# Altium schematic sheet rf-switch.SchDoc: Mini RF Synth [Master]
size A4; DocumentNumber: 1; SheetNumber: 1; SheetTotal: 1
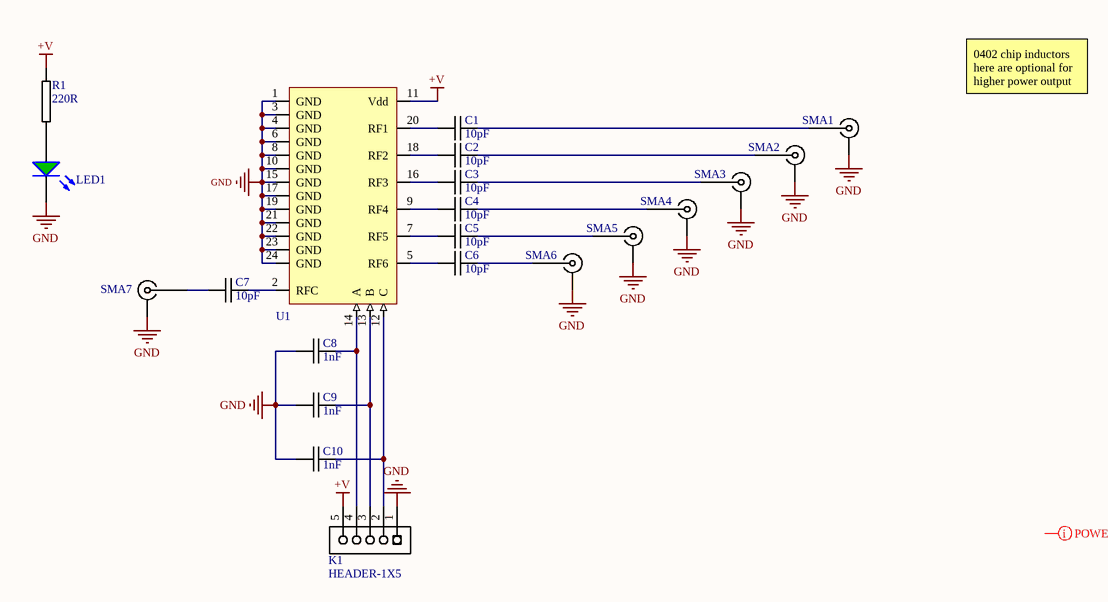
[diagram p0: rf-switch.SchDoc]

## Parts
C1  10pF  [0603C-GENERIC]
C2  10pF  [0603C-GENERIC]
C3  10pF  [0603C-GENERIC]
C4  10pF  [0603C-GENERIC]
C5  10pF  [0603C-GENERIC]
C6  10pF  [0603C-GENERIC]
C7  10pF  [0603C-GENERIC]
C8  1nF  [0603C-GENERIC]
C9  1nF  [0603C-GENERIC]
C10  1nF  [0603C-GENERIC]
K1  HEADER-1X5  [HEADER-1X5]
LED1  Green  [0805LED - GREEN]  (value not drawn)
R1  220R  [0603R-220]
SMA1  MOLEX_SMA_EDGE  [MOLEX_SMA_EDGE]  (value not drawn)
SMA2  MOLEX_SMA_EDGE  [MOLEX_SMA_EDGE]  (value not drawn)
SMA3  MOLEX_SMA_EDGE  [MOLEX_SMA_EDGE]  (value not drawn)
SMA4  MOLEX_SMA_EDGE  [MOLEX_SMA_EDGE]  (value not drawn)
SMA5  MOLEX_SMA_EDGE  [MOLEX_SMA_EDGE]  (value not drawn)
SMA6  MOLEX_SMA_EDGE  [MOLEX_SMA_EDGE]  (value not drawn)
SMA7  MOLEX_SMA_EDGE  [MOLEX_SMA_EDGE]  (value not drawn)
U1  HMC252A  [HMC252A-QSOP24]  (value not drawn)

## Nets
+V: K1.5 R1.1 U1.11(Vdd)
GND: C8.1 C9.1 C10.1 K1.1 LED1.K SMA1.2 SMA2.2 SMA3.2 SMA4.2 SMA5.2 SMA6.2 SMA7.2 U1.1(GND) U1.3(GND) U1.4(GND) U1.6(GND) U1.8(GND) U1.10(GND) U1.15(GND) U1.17(GND) U1.19(GND) U1.21(GND) U1.22(GND) U1.23(GND) U1.24(GND)
NetC1_1: C1.1 U1.20(RF1)
NetC1_2: C1.2 SMA1.1
NetC2_1: C2.1 U1.18(RF2)
NetC2_2: C2.2 SMA2.1
NetC3_1: C3.1 U1.16(RF3)
NetC3_2: C3.2 SMA3.1
NetC4_1: C4.1 U1.9(RF4)
NetC4_2: C4.2 SMA4.1
NetC5_1: C5.1 U1.7(RF5)
NetC5_2: C5.2 SMA5.1
NetC6_1: C6.1 U1.5(RF6)
NetC6_2: C6.2 SMA6.1
NetC7_1: C7.1 SMA7.1
NetC7_2: C7.2 U1.2(RFC)
NetC8_2: C8.2 K1.4 U1.14(A)
NetC9_2: C9.2 K1.3 U1.13(B)
NetC10_2: C10.2 K1.2 U1.12(C)
NetLED1_A: LED1.A R1.2

## Layout directives
net class POWER: (no net found under the mark)

## Notes on the sheet
- 0402 chip inductors here are optional for higher power output
- Title:
- Date:
- Sheet:
- of
- File:

## Library data of the parts
C1-C7 = 0603C-10PF-50V-C0G-MUR: CAPACITOR 0603 CERAMIC; Reel: C2
C8-C10 = 0603C-1NF-50V-X7R: CAPACITOR 0603 CERAMIC
K1 = HEADER-1X5: PINHEADER 1X5; REEL: TH; Supplier 1: Digi-Key; Supplier Part Number 1: S1011E-36-ND
LED1 = 0805 SMD LED - GREEN: Supplier 1: Digi-Key; Supplier Part Number 1: 160-1426-1-ND
R1 = 0603R-220: GENERIC RESISTOR 0603; Manufacturer: Stackpole Electronics Inc; Manufacturer Part Number: RMCF 1/16 220 1% R; Resistance In Ohms: 220; Power (Watts): 0.1W, 1/10W; Tolerance: ±1%; Temperature Coefficient: ±100ppm/°C; Supplier 1: Digi-Key; Supplier Part Number 1: RMCF1/16220FRCT-ND; Lead Style: Surface Mount (SMD - SMT); Case: 0603 (1608 metric); RoHS: RoHS Compliant; Supplier: Digi-Key; Packaging: Cut Tape (CT); Composition: Thick Film; Supplier Part Number: RMCF1/16220FRCT-ND; Category: Resistors
SMA1-SMA7 = MOLEX_SMA_EDGE: Supplier 1: Digi-Key; Supplier Part Number 1: WM5534-ND
U1 = HMC252A: Supplier 1: Digi-Key; Supplier Part Number 1: 1127-3181-ND